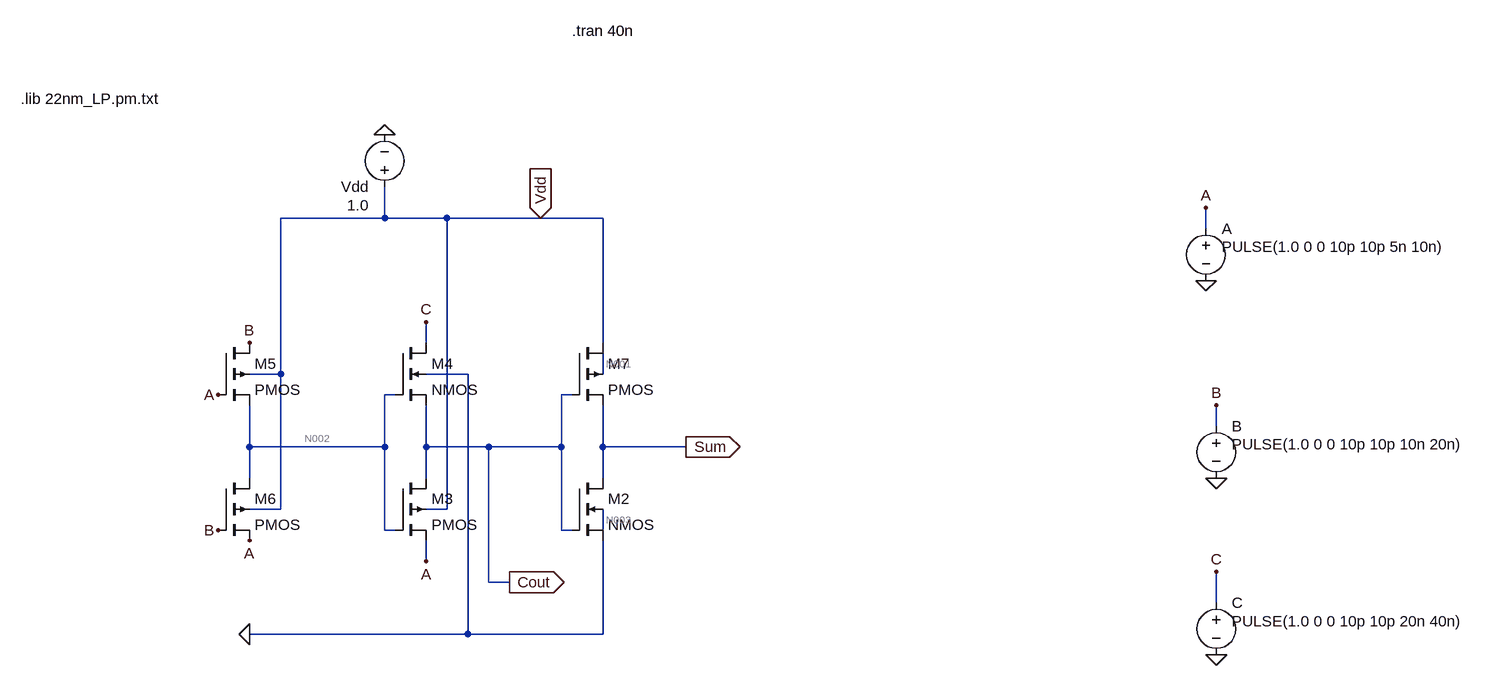
[diagram p0: schematic InXA3_45nm.asc]
InXA3_45nm.asc, the LTspice schematic file:
Version 4
SHEET 1 1044 692
WIRE -640 -240 -640 -288
WIRE -640 -240 -800 -240
WIRE -544 -240 -640 -240
WIRE -400 -240 -544 -240
WIRE -304 -240 -400 -240
WIRE 624 -224 624 -256
WIRE -576 -48 -576 -80
WIRE -304 -48 -304 -240
WIRE -800 0 -800 -240
WIRE -800 0 -848 0
WIRE -512 0 -576 0
WIRE -304 0 -304 -32
WIRE -624 32 -640 32
WIRE -352 32 -368 32
WIRE 640 80 640 48
WIRE -848 112 -848 48
WIRE -640 112 -640 32
WIRE -640 112 -848 112
WIRE -576 112 -576 48
WIRE -480 112 -576 112
WIRE -368 112 -368 32
WIRE -368 112 -480 112
WIRE -304 112 -304 48
WIRE -176 112 -304 112
WIRE -848 160 -848 112
WIRE -576 160 -576 112
WIRE -304 160 -304 112
WIRE -800 208 -800 0
WIRE -800 208 -848 208
WIRE -544 208 -544 -240
WIRE -544 208 -576 208
WIRE -640 240 -640 112
WIRE -624 240 -640 240
WIRE -368 240 -368 112
WIRE -352 240 -368 240
WIRE -304 240 -304 208
WIRE -576 288 -576 256
WIRE -480 320 -480 112
WIRE -448 320 -480 320
WIRE 640 352 640 304
WIRE -512 400 -512 0
WIRE -512 400 -848 400
WIRE -304 400 -304 256
WIRE -304 400 -512 400
FLAG 624 -144 0
FLAG 640 160 0
FLAG 640 432 0
FLAG 624 -256 A
FLAG 640 48 B
FLAG 640 304 C
FLAG -400 -240 Vdd
IOPIN -400 -240 In
FLAG -640 -368 0
FLAG -896 32 A
FLAG -848 256 A
FLAG -896 240 B
FLAG -848 -48 B
FLAG -448 320 Cout
IOPIN -448 320 Out
FLAG -576 -80 C
FLAG -848 400 0
FLAG -576 288 A
FLAG -176 112 Sum
IOPIN -176 112 Out
SYMBOL voltage 624 -240 R0
WINDOW 3 24 44 Left 2
WINDOW 123 0 0 Left 0
WINDOW 39 0 0 Left 0
SYMATTR Value PULSE(1.0 0 0 10p 10p 5n 10n)
SYMATTR InstName A
SYMBOL voltage 640 64 R0
WINDOW 3 24 44 Left 2
WINDOW 123 0 0 Left 0
WINDOW 39 0 0 Left 0
SYMATTR Value PULSE(1.0 0 0 10p 10p 10n 20n)
SYMATTR InstName B
SYMBOL voltage 640 336 R0
WINDOW 3 24 44 Left 2
WINDOW 123 0 0 Left 0
WINDOW 39 0 0 Left 0
SYMATTR Value PULSE(1.0 0 0 10p 10p 20n 40n)
SYMATTR InstName C
SYMBOL voltage -640 -272 R180
WINDOW 3 24 -12 Left 2
WINDOW 123 0 0 Left 0
WINDOW 39 0 0 Left 0
SYMATTR Value 1.0
SYMATTR InstName Vdd
SYMBOL nmos4 -352 160 R0
SYMATTR InstName M2
SYMATTR Value2 l=45n w=1u
SYMBOL nmos4 -624 -48 R0
SYMATTR InstName M4
SYMATTR Value2 l=45n w=1u
SYMBOL pmos4 -624 160 R0
SYMATTR InstName M3
SYMATTR Value2 l=45n w=2u
SYMBOL pmos4 -896 -48 R0
SYMATTR InstName M5
SYMATTR Value2 l=45n w=2u
SYMBOL pmos4 -896 160 R0
SYMATTR InstName M6
SYMATTR Value2 l=45n w=2u
SYMBOL pmos4 -352 -48 R0
SYMATTR InstName M7
SYMATTR Value2 l=45n w=2u
TEXT -1200 -424 Left 2 !.lib 22nm_LP.pm.txt
TEXT -352 -528 Left 2 !.tran 40n

The netlist it stands for:
* InXA3_45nm.asc
V§A A 0 PULSE(1.0 0 0 10p 10p 5n 10n)
V§B B 0 PULSE(1.0 0 0 10p 10p 10n 20n)
V§C C 0 PULSE(1.0 0 0 10p 10p 20n 40n)
Vdd Vdd 0 1.0
M2 Sum Cout 0 N003 NMOS l=45n w=1u
M4 C N002 Cout 0 NMOS l=45n w=1u
M3 Cout N002 A Vdd PMOS l=45n w=2u
M5 B A N002 Vdd PMOS l=45n w=2u
M6 N002 B A Vdd PMOS l=45n w=2u
M7 Vdd Cout Sum N001 PMOS l=45n w=2u
.model NMOS NMOS
.model PMOS PMOS
.lib standard.mos
.lib 22nm_LP.pm.txt
.tran 40n
.backanno
.end

* Results of the author's LTspice run, read from the files saved beside the schematic
* Operating Point, zero values left out:
*   V(a) = 1 V
*   V(b) = 1 V
*   V(c) = 1 V
*   V(vdd) = 1 V
*   V(sum) = 434.4 µV
*   V(cout) = 830.7 mV
*   V(n003) = 142.6 mV
*   V(n002) = 997.3 mV
*   V(n001) = 866.4 mV
*   Id(M7) = 1.781 µA
*   Ig(M7) = 749.3 pA
*   Is(M7) = -1.782 µA
*   Id(M6) = -7.023 pA
*   Is(M6) = 6.936 pA
*   Id(M5) = 6.936 pA
*   Is(M5) = -7.022 pA
*   Id(M3) = -197 pA
*   Ig(M3) = 14 pA
*   Is(M3) = 182.8 pA
*   Id(M4) = 679.5 pA
*   Ib(M4) = -1.87 pA
*   Is(M4) = -677.6 pA
*   Id(M2) = 1.782 µA
*   Ig(M2) = 125.3 pA
*   Is(M2) = -1.782 µA
*   I(Vdd) = -1.781 µA
*   I(C) = -679.5 pA
*   I(B) = -7.02 pA
*   I(A) = -189.9 pA
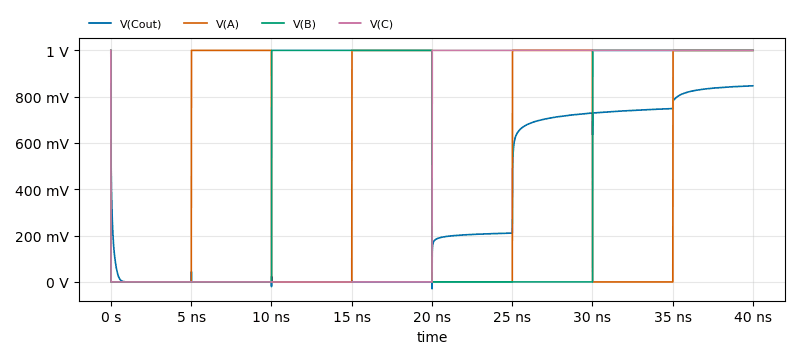
[diagram p1: Transient Analysis of InXA3_45nm.asc, plotted from the saved traces]
* Transient Analysis, 1 run:
*   V(Cout): min -29.67 mV, max 847 mV, average 310.7 mV, rms 470.7 mV, last 847 mV
*   V(A): min 0 V, max 1 V, average 499 mV, rms 706.2 mV, last 1 V
*   V(B): min 0 V, max 1 V, average 499.5 mV, rms 706.6 mV, last 1 V
*   V(C): min 0 V, max 1 V, average 499.7 mV, rms 706.9 mV, last 1 V